# Altium schematic sheet Main.SchDoc
size A3; PageSetup: Record=PageOptions|CenterHorizontal=True|CenterVertical=True|PrintScale=0.67|XCorrection=1.00|YCorrection=1.00|PrintKind=2|BorderSize=5000000|LeftOffset=0|BottomOffset=0|Orientation=2|PaperLength=2970|PaperWidth=2100|Scale=100|PaperSource=7|PrintQuality=300|MediaType=1|DitherType=2|PrintScaleMode=1|PaperKind=A4|PaperIndex=9; Scale: 1:1; DocumentType: Схема электрическая принципиальная; FirstReferrence: АБВГ.123456.001
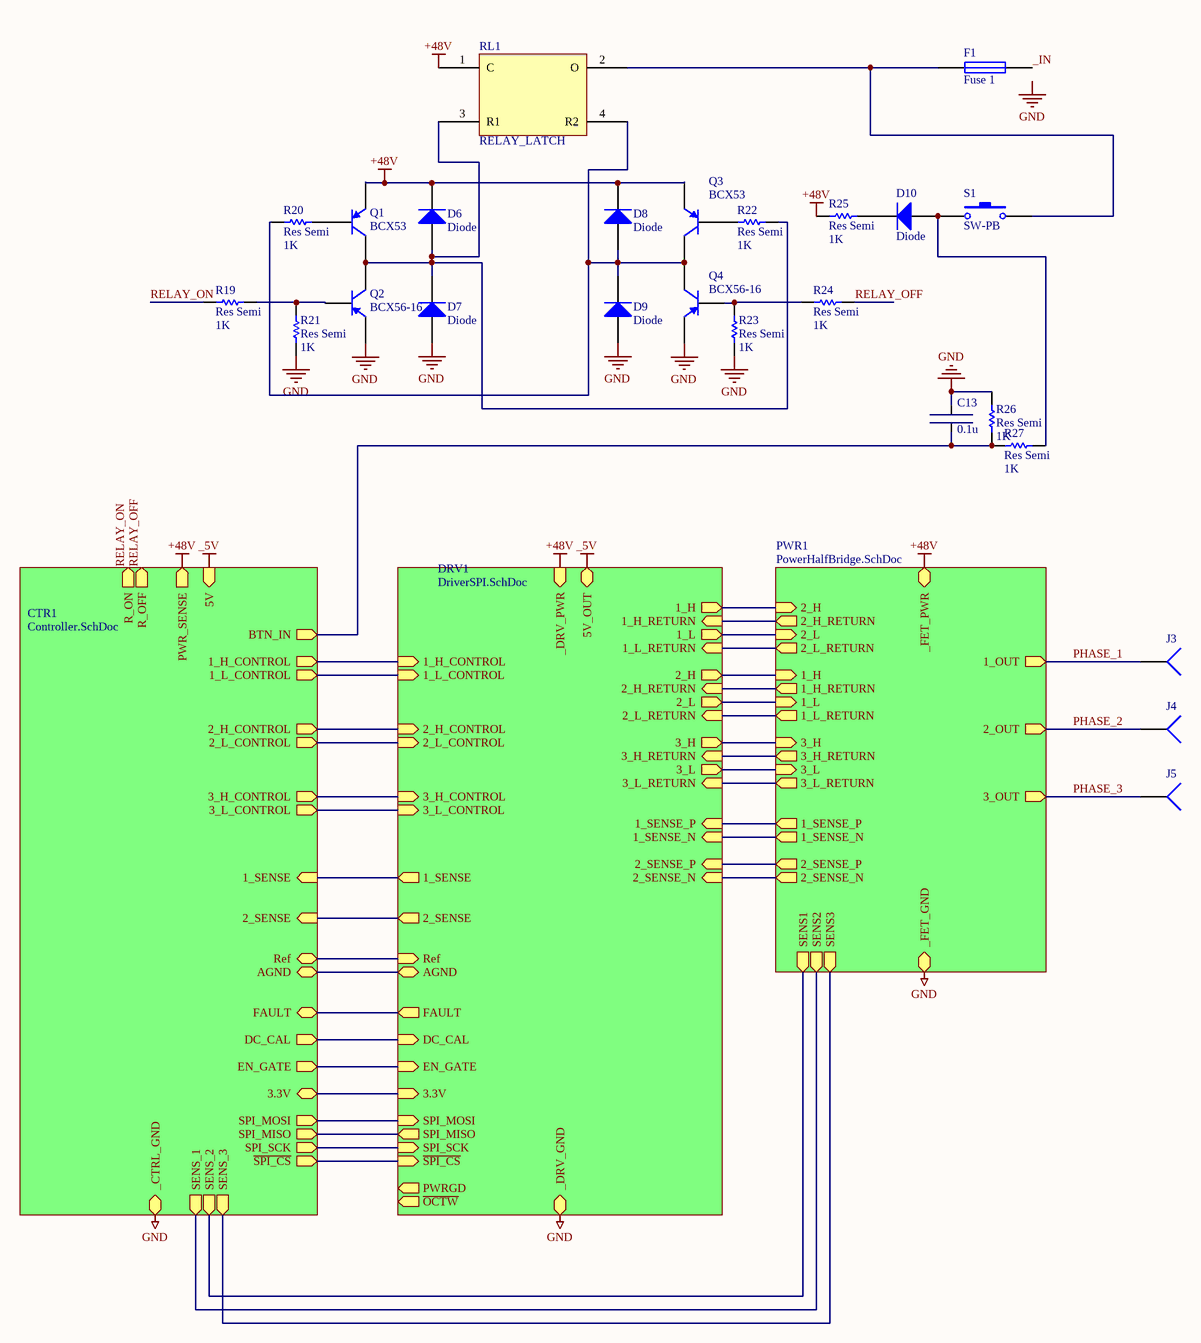
[diagram p0: Main.SchDoc]

## Parts
C13  0.1u  [0805x]
D6  Diode  [DO214]
D7  Diode  [DO214]
D8  Diode  [DO214]
D9  Diode  [DO214]
D10  Diode  [SMB]
F1  Fuse 1  [FUSE_BIG]
J3  1  [BANANA-4MM]  (value not drawn)  (no BOM)
J4  2  [BANANA-4MM]  (value not drawn)  (no BOM)
J5  3  [BANANA-4MM]  (value not drawn)  (no BOM)
Q1  BCX53  [SOT89x]
Q2  BCX56-16  [SOT89x]
Q3  BCX53  [SOT89x]
Q4  BCX56-16  [SOT89x]
R19  Res Semi  value 1K  [0805x]
R20  Res Semi  value 1K  [0805x]
R21  Res Semi  value 1K  [0805x]
R22  Res Semi  value 1K  [0805x]
R23  Res Semi  value 1K  [0805x]
R24  Res Semi  value 1K  [0805x]
R25  Res Semi  value 1K  [RES_2W]
R26  Res Semi  value 1K  [0805x]
R27  Res Semi  value 1K  [0805x]
RL1  RELAY_LATCH  [LATCH_RELAY]
S1  SW-PB  [BTN_SMD_CORNER]

## Sub-sheets
CTR1 = Controller.SchDoc: FAULT, 1_L_CONTROL (out), 2_L_CONTROL (out), 3_L_CONTROL (out), DC_CAL (out), SPI_SCK (out), PWR_SENSE (out), 3_H_CONTROL (out), 2_H_CONTROL (out), 1_H_CONTROL (out), SPI_MOSI (out), ~{SPI_CS} (out), 1_SENSE (in), 2_SENSE (in), 5V (in), EN_GATE (out), _CTRL_GND, 3.3V, Ref, AGND, SPI_MISO (out), SENS_1 (out), SENS_2 (out), SENS_3 (out), BTN_IN (out), R_ON (out), R_OFF (out)
DRV1 = DriverSPI.SchDoc: 2_H (out), 1_H (out), 3_H (out), 2_L (out), 1_L (out), 3_L (out), 1_SENSE_P (in), 1_SENSE_N (in), 2_SENSE_P (in), 2_SENSE_N (in), 2_H_RETURN (in), 2_L_RETURN (in), 1_H_RETURN (in), 3_H_RETURN (in), 1_L_RETURN (in), 3_L_RETURN (in), 2_H_CONTROL (in), 2_L_CONTROL (in), 1_H_CONTROL (in), 1_L_CONTROL (in), 3_H_CONTROL (in), 3_L_CONTROL (in), 1_SENSE (out), 2_SENSE (out), _DRV_PWR (in), _DRV_GND (bidir), Ref (in), AGND (bidir), 5V_OUT, FAULT (out), EN_GATE (in), DC_CAL (in), 3.3V (in), SPI_MOSI (in), SPI_MISO (out), ~{SPI_CS} (in), SPI_SCK (in), PWRGD (out), ~{OCTW} (out)
PWR1 = PowerHalfBridge.SchDoc: 1_H (in), 2_H (in), 3_H (in), 1_L (in), 2_L (in), 3_L (in), 1_SENSE_P (out), 1_SENSE_N (out), 2_SENSE_N (out), 2_SENSE_P (out), _FET_PWR, _FET_GND, 1_OUT (out), 2_OUT (out), 3_OUT (out), 1_H_RETURN (out), 1_L_RETURN (out), 2_H_RETURN (out), 3_H_RETURN (out), 2_L_RETURN (out), 3_L_RETURN (out), SENS1 (out), SENS2 (out), SENS3 (out)

## Nets
+48V: D6.2(K) D8.2(K) Q1.1(E) Q3.1(E) R25.1 RL1.1(C) ; sheet PWR1/_FET_PWR, sheet DRV1/_DRV_PWR, sheet CTR1/PWR_SENSE
_5V: sheet DRV1/5V_OUT, sheet CTR1/5V
GND: C13.1 D7.1(A) D9.1(A) Q2.1(E) Q4.1(E) R21.1 R23.1 R26.1 ; sheet PWR1/_FET_GND, sheet DRV1/_DRV_GND, sheet CTR1/_CTRL_GND
_IN: F1.2
PHASE_1: J3.1 ; sheet PWR1/1_OUT
PHASE_2: J4.1 ; sheet PWR1/2_OUT
PHASE_3: J5.1 ; sheet PWR1/3_OUT
RELAY_OFF: R24.1 ; sheet CTR1/R_OFF
RELAY_ON: R19.1 ; sheet CTR1/R_ON
NetC13_2: C13.2 R26.2 R27.1 ; sheet CTR1/BTN_IN
NetD6_1: D6.1(A) D7.2(K) Q1.2(C) Q2.2(C) R22.2 RL1.3(R1)
NetD8_1: D8.1(A) D9.2(K) Q3.2(C) Q4.2(C) R20.1 RL1.4(R2)
NetD10_1: D10.1(A) R27.2 S1.1
NetD10_2: D10.2(K) R25.2
NetF1_1: F1.1 RL1.2(O) S1.2
NetQ1_3: Q1.3(B) R20.2
NetQ2_3: Q2.3(B) R19.2 R21.2
NetQ3_3: Q3.3(B) R22.1
NetQ4_3: Q4.3(B) R23.2 R24.2
(unnamed): sheet PWR1/1_H, sheet DRV1/2_H
(unnamed): sheet PWR1/2_H, sheet DRV1/1_H
(unnamed): sheet PWR1/3_H, sheet DRV1/3_H
(unnamed): sheet PWR1/1_L, sheet DRV1/2_L
(unnamed): sheet PWR1/2_L, sheet DRV1/1_L
(unnamed): sheet PWR1/3_L, sheet DRV1/3_L
(unnamed): sheet PWR1/1_SENSE_P, sheet DRV1/1_SENSE_P
(unnamed): sheet PWR1/1_SENSE_N, sheet DRV1/1_SENSE_N
(unnamed): sheet PWR1/2_SENSE_N, sheet DRV1/2_SENSE_N
(unnamed): sheet PWR1/2_SENSE_P, sheet DRV1/2_SENSE_P
(unnamed): sheet PWR1/1_H_RETURN, sheet DRV1/2_H_RETURN
(unnamed): sheet PWR1/1_L_RETURN, sheet DRV1/2_L_RETURN
(unnamed): sheet PWR1/2_H_RETURN, sheet DRV1/1_H_RETURN
(unnamed): sheet PWR1/3_H_RETURN, sheet DRV1/3_H_RETURN
(unnamed): sheet PWR1/2_L_RETURN, sheet DRV1/1_L_RETURN
(unnamed): sheet PWR1/3_L_RETURN, sheet DRV1/3_L_RETURN
(unnamed): sheet PWR1/SENS1, sheet CTR1/SENS_2
(unnamed): sheet PWR1/SENS2, sheet CTR1/SENS_1
(unnamed): sheet PWR1/SENS3, sheet CTR1/SENS_3
(unnamed): sheet DRV1/2_H_CONTROL, sheet CTR1/2_H_CONTROL
(unnamed): sheet DRV1/2_L_CONTROL, sheet CTR1/2_L_CONTROL
(unnamed): sheet DRV1/1_H_CONTROL, sheet CTR1/1_H_CONTROL
(unnamed): sheet DRV1/1_L_CONTROL, sheet CTR1/1_L_CONTROL
(unnamed): sheet DRV1/3_H_CONTROL, sheet CTR1/3_H_CONTROL
(unnamed): sheet DRV1/3_L_CONTROL, sheet CTR1/3_L_CONTROL
(unnamed): sheet DRV1/1_SENSE, sheet CTR1/1_SENSE
(unnamed): sheet DRV1/2_SENSE, sheet CTR1/2_SENSE
(unnamed): sheet DRV1/Ref, sheet CTR1/Ref
(unnamed): sheet DRV1/AGND, sheet CTR1/AGND
(unnamed): sheet DRV1/FAULT, sheet CTR1/FAULT
(unnamed): sheet DRV1/EN_GATE, sheet CTR1/EN_GATE
(unnamed): sheet DRV1/DC_CAL, sheet CTR1/DC_CAL
(unnamed): sheet DRV1/3.3V, sheet CTR1/3.3V
(unnamed): sheet DRV1/SPI_MOSI, sheet CTR1/SPI_MOSI
(unnamed): sheet DRV1/SPI_MISO, sheet CTR1/SPI_MISO
(unnamed): sheet DRV1/~{SPI_CS}, sheet CTR1/~{SPI_CS}
(unnamed): sheet DRV1/SPI_SCK, sheet CTR1/SPI_SCK

## Notes on the sheet
- Labels drawn without touching a wire or pin: GND
- Title
- Size:
- Date:
- A3
- Number:
- Time:
- Revision:
- Sheet
- of
- File:

## Library data of the parts
C13 = Ceramic Chip Capacitor: Value: CAP CER 0.1UF 50V X7R 0603; Order Number: 06035C104KAT2A; Distributor: AVX Corporation; Package: CAPC1608X08N(0603)
D6-D10 = Diode: Default Diode; Published: 8-Jun-2000; LatestRevisionDate: 17-Jul-2002; LatestRevisionNote: Re-released for DXP Platform.; PackageVersion: Sep-1996; PackageReference: SMC; Publisher: Altium Limited; PackageDescription: DO-214-AB/SMC; 2 C-Bend Leads; Body 7.9 x 5.9 mm, inc. leads (LxW); Code_JEDEC: DO-214-AB
F1 = Fuse 1: Fuse; Published: 8-Jun-2000; LatestRevisionDate: 17-Jul-2002; LatestRevisionNote: Re-released for DXP Platform.; PackageReference: PIN-W2/E2.8; Publisher: Altium Limited; PackageDescription: Thru-Hole; 2 Leads
J3-J5 = Socket: LatestRevisionDate: 17-Jul-2002; LatestRevisionNote: Re-released for DXP Platform.; Publisher: Altium Limited
Q1 Q3 = BCX53: PNP Medium Power Transistor; Published: 17-Sep-2003; LatestRevisionDate: 06-Jun-2005; LatestRevisionNote: PCB pad sequence reversed.; DatasheetVersion: 10-Oct-2001; PackageVersion: Apr-1999; PackageReference: SOT89; Publisher: Altium Limited; PackageDescription: SOT-89; Body 4.6 x 4.25 mm, inc. leads (LxW max); Reverse Pinning; Code_JEITA: SC-62; Code_JEDEC: TO-243-AA; Code_IPC: SOT 89; ComponentLink1Description: Manufacturer Link; ComponentLink1URL: http://www.semiconductors.philips.com/; ComponentLink2Description: Datasheet; ComponentLink2URL: http://www.semiconductors.philips.com/acrobat/datasheets/BCX51_52_53_4.pdf
Q2 Q4 = BCX53-16: PNP Medium Power Transistor; Published: 17-Sep-2003; LatestRevisionDate: 06-Jun-2005; LatestRevisionNote: PCB pad sequence reversed.; DatasheetVersion: 10-Oct-2001; PackageVersion: Apr-1999; PackageReference: SOT89; Publisher: Altium Limited; PackageDescription: SOT-89; Body 4.6 x 4.25 mm, inc. leads (LxW max); Reverse Pinning; Code_JEITA: SC-62; Code_JEDEC: TO-243-AA; Code_IPC: SOT 89; ComponentLink1Description: Manufacturer Link; ComponentLink1URL: http://www.semiconductors.philips.com/; ComponentLink2Description: Datasheet; ComponentLink2URL: http://www.semiconductors.philips.com/acrobat/datasheets/BCX51_52_53_4.pdf
R19-R27 = Res Semi: Semiconductor Resistor; Published: 8-Jun-2000; LatestRevisionDate: 17-Jul-2002; LatestRevisionNote: Re-released for DXP Platform.; PackageReference: AXIAL-0.5; Publisher: Altium Limited; PackageDescription: Axial Device, Thru-Hole; 2 Leads; 0.5 in Pin Spacing
S1 = SW-PB: Switch; Published: 24-Mar-1999; LatestRevisionDate: 17-Jul-2002; LatestRevisionNote: Re-released for DXP Platform.; PackageReference: SPST-2; Publisher: Altium Limited; PackageDescription: Switch; 2 Leads